# Altium project Output_Protection.PrjPCB
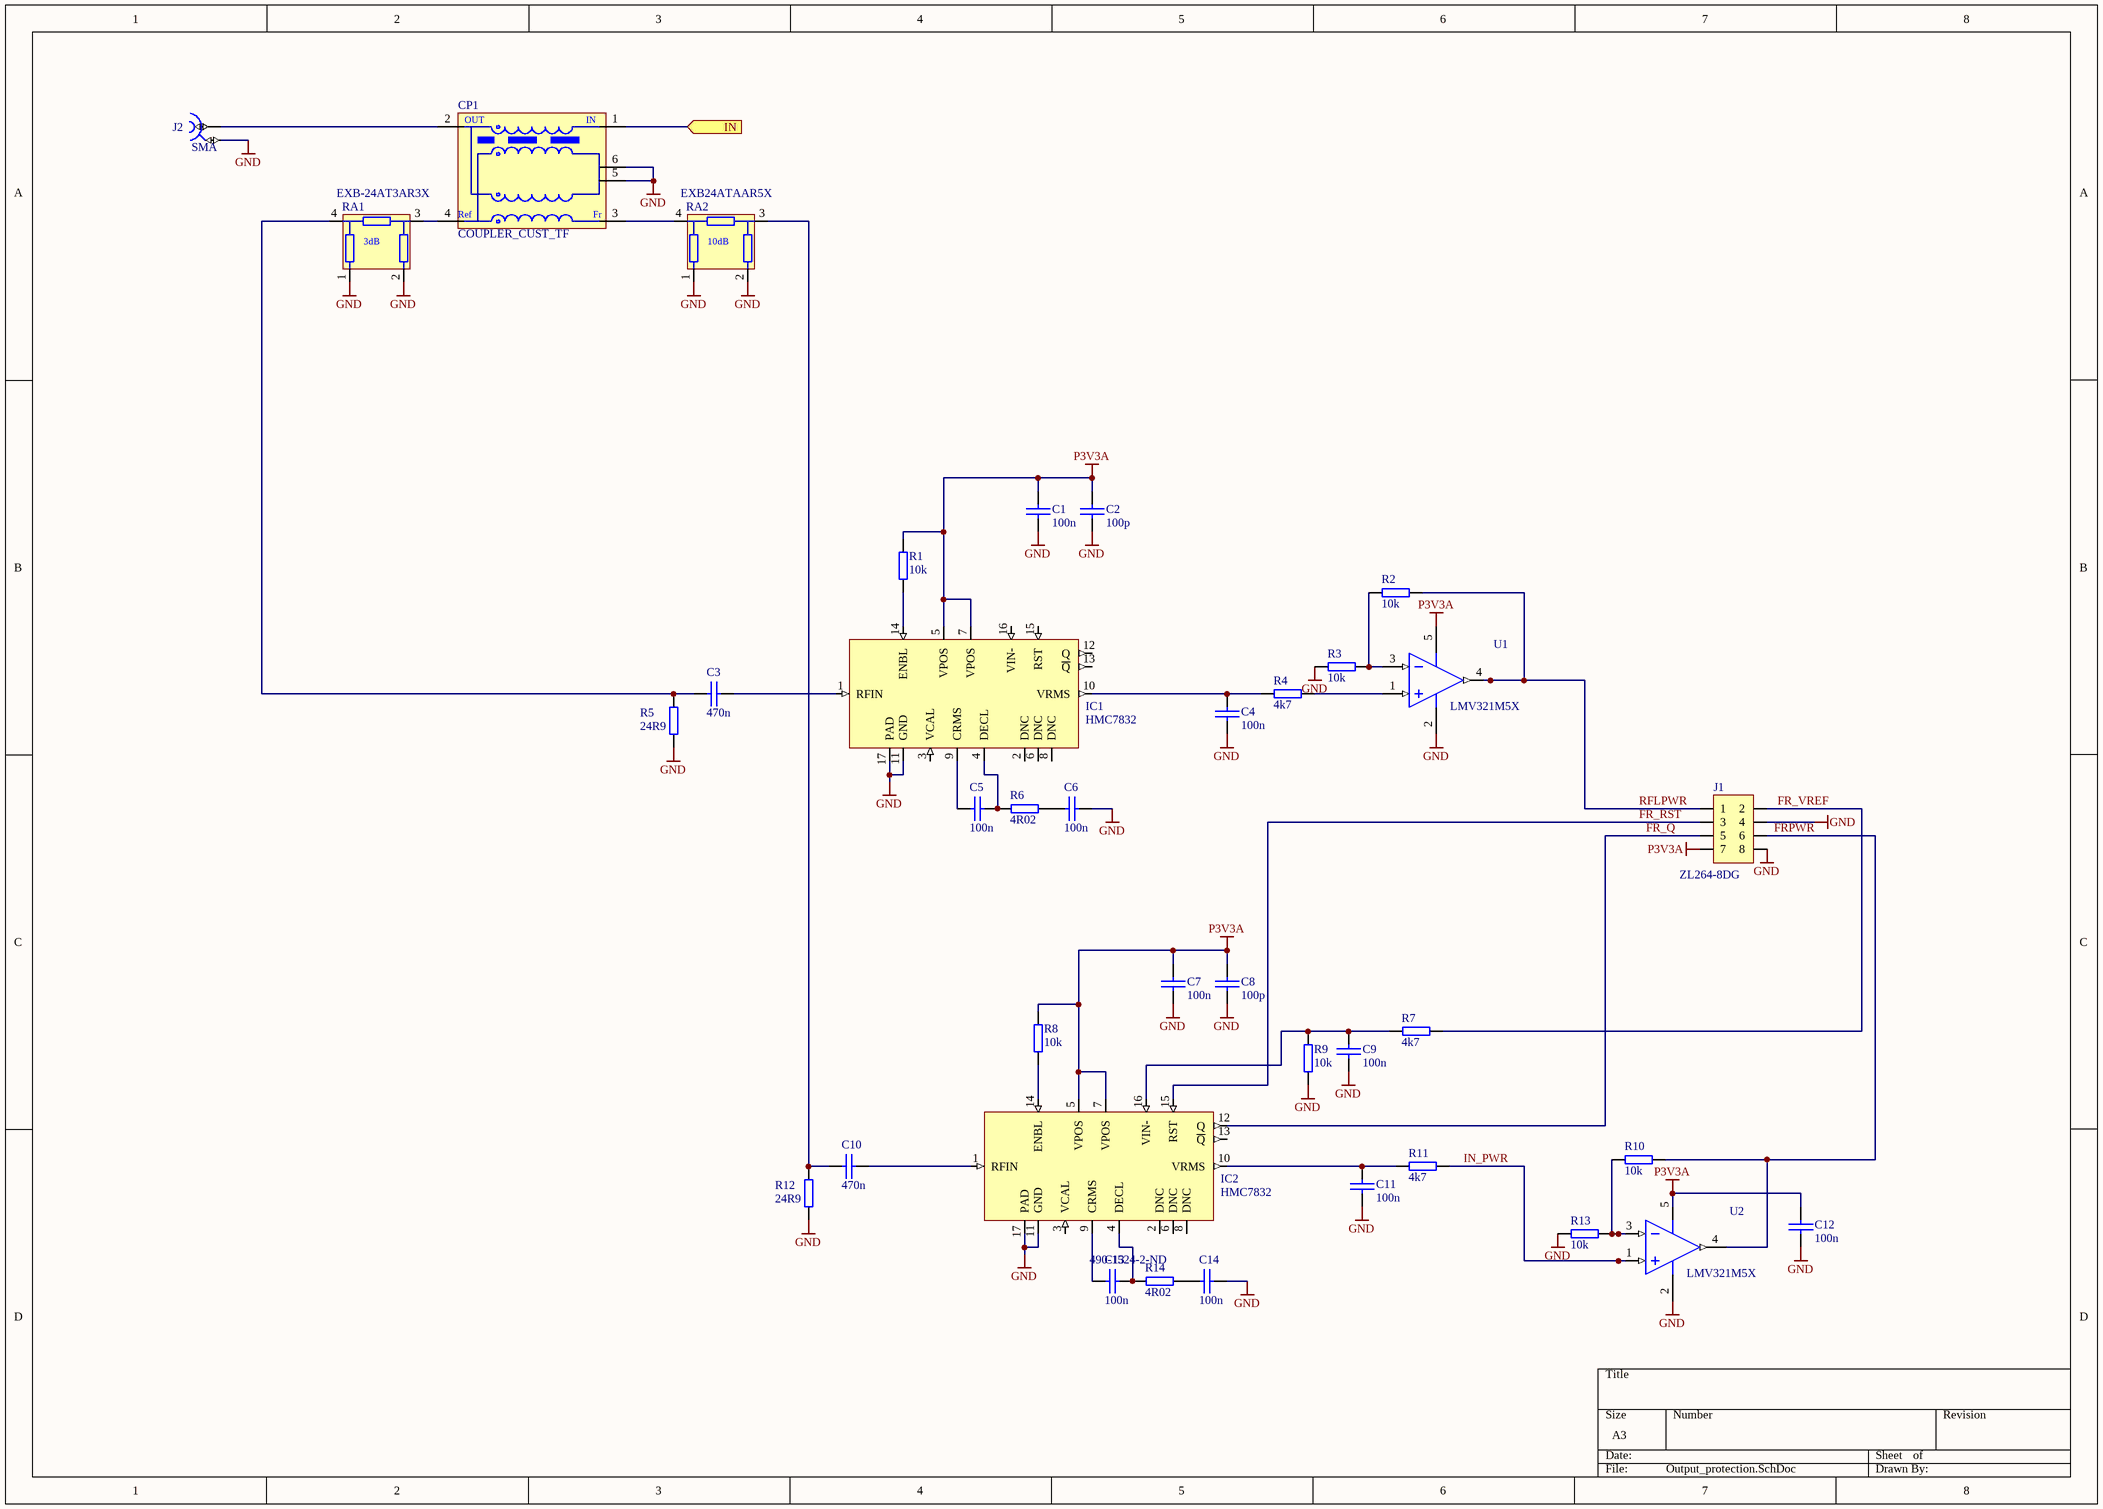
[diagram p0: Output_protection.SchDoc]
1 sheet, 37 parts. Net scope: flat (ports and power ports of the same name join across sheets).
Board file: PA_Channel_RF3.PcbDoc

## Sheet Output_protection.SchDoc
size A3

### Parts
C1  100n  [0603C]
C2  100p  [0603C]
C3  470n  [0603C]
C4  100n  [0603C]
C5  100n  [0603C]
C6  100n  [0603C]
C7  100n  [0603C]
C8  100p  [0603C]
C9  100n  [0603C]
C10  470n  [0603C]
C11  100n  [0603C]
C12  100n  [0603C]
C13  100n  Supplier Part Number 1: 490-1524-2-ND  [0603C]
C14  100n  [0603C]
CP1  COUPLER_CUST_TF  [COUPLER_CUST_TF]
IC1  HMC7832  [QFN50P300X300X80_HS-17N]
IC2  HMC7832  [QFN50P300X300X80_HS-17N]
J1  ZL264-8DG  [ZL264-8DG]
J2  SMA  [MOLEX_73251-2121]
R1  10k  [0603R]
R2  10k  [0603R]
R3  10k  [0603R]
R4  4k7  [0603R]
R5  24R9  [0603R]
R6  4R02  [0603R]
R7  4k7  [0603R]
R8  10k  [0603R]
R9  10k  [0603R]
R10  10k  [0603R]
R11  4k7  [0603R]
R12  24R9  [0603R]
R13  10k  [0603R]
R14  4R02  [0603R]
RA1  EXB-24AT3AR3X  [CAC-65P100X100-4L]
RA2  EXB24ATAAR5X  [CAC-65P100X100-4L]
U1  LMV321M5X  [DBV0005A_N]
U2  LMV321M5X  [DBV0005A_N]

### Ports
IN (in)

### Nets
GND: C1.2 C2.2 C4.1 C6.2 C7.2 C8.2 C9.1 C11.1 C12.1 C14.2 CP1.5 CP1.6 IC1.11(GND) IC1.17(PAD) IC2.11(GND) IC2.17(PAD) J1.4 J1.8 J2.2 R3.2 R5.2 R9.1 R12.2 R13.2 RA1.1 RA1.2 RA2.1 RA2.2 U1.2(V-) U2.2(V-)
P3V3A: C1.1 C2.1 C7.1 C8.1 C12.2 IC1.5(VPOS) IC1.7(VPOS) IC2.5(VPOS) IC2.7(VPOS) J1.7 R1.1 R8.1 U1.5(V+) U2.5(V+)
FR_Q: IC2.12(Q) J1.5
FR_RST: IC2.15(RST) J1.3
FR_VREF: J1.2 R7.1
FRPWR: J1.6 R10.1 U2.4(OUT)
IN_PWR: R11.1 U2.1(IN+)
RFLPWR: J1.1 R2.1 U1.4(OUT)
NetC3_1: C3.1 R5.1 RA1.4
NetC3_2: C3.2 IC1.1(RFIN)
NetC4_2: C4.2 IC1.10(VRMS) R4.2
NetC5_1: C5.1 IC1.9(CRMS)
NetC5_2: C5.2 IC1.4(DECL) R6.1
NetC6_1: C6.1 R6.2
NetC9_2: C9.2 IC2.16(VIN-) R7.2 R9.2
NetC10_1: C10.1 R12.1 RA2.3
NetC10_2: C10.2 IC2.1(RFIN)
NetC11_2: C11.2 IC2.10(VRMS) R11.2
NetC13_1: C13.1 IC2.9(CRMS)
NetC13_2: C13.2 IC2.4(DECL) R14.1
NetC14_1: C14.1 R14.2
NetCP1_1: CP1.1 ; port IN
NetCP1_2: CP1.2 J2.1
NetCP1_3: CP1.3 RA2.4
NetCP1_4: CP1.4 RA1.3
NetIC1_14: IC1.14(ENBL) R1.2
NetIC2_14: IC2.14(ENBL) R8.2
NetR2_2: R2.2 R3.1 U1.3(IN-)
NetR4_1: R4.1 U1.1(IN+)
NetR10_2: R10.2 R13.1 U2.3(IN-)

Not connected (* = marked no-connect by the designer): IC1 2(DNC) 3(VCAL) 6(DNC) 8(DNC) 12(Q) 13(~{Q}) 15(RST) 16(VIN-); IC2 2(DNC) 3(VCAL) 6(DNC) 8(DNC) 13(~{Q})

### Notes on the sheet
- (in symbol IND_COUPLER_TF) OUT; IN; Ref; Fr
- (in symbol RES_ATT_3dB) 3dB
- (in symbol RES_ATT_10dB) 10dB

### Library data of the parts
C1 C4-C7 C9 C11-C14 = CAP_SMD_0603: Capacitor SMD; Part: GRM188L81H104KA93D
  C1 C4-C6 C9 C11 C12 C14: Supplier 1: Digi-Key
C2 C8 = CAP_SMD_0603: Capacitor SMD; Part: C1608NP01H101J080AA; Supplier 1: Digi-Key
C3 C10 = CAP_SMD_0603: Capacitor SMD; Part: GRM188R71A474KA61D; Supplier 1: Digi-Key
CP1 = IND_COUPLER_TF: custom coupler
IC1 IC2 = ADL5904: DC   to 6 GHz  , 45 dB DC  to 6 GHz , 45 dB TruPwr Detector with Envelope Threshold Detection
J1 = CON_2X4 2.54 SMT FEM: 2.54mm pitch connector
J2 = MOLEX_73251-2121: Part Description: 50 Ohm, SMA Edge Mount PCB, With Jam Nut And Lock Washer; Manufacturer: MOLEX; PressFit: No; Part Number: MOLEX_73251-2121; Component Kind: Standard; Component Type: Standard; Pin Count: 5; Family: SMA; Mounted: Yes; Socket: No; SMD: Yes; Sense: No; Status: None; Manufacturer Part Number: 73251-2121; ComponentHeight: 5.75mm; HelpURL: \\cern.ch\dfs\Applications\Altium\Datasheets\MOLEX_73251-2121.pdf; Author: CERN DEM JLC; CreateDate: 26.10.2016; LatestRevisionDate: 26.10.2016
R1-R3 R8-R10 R13 = RES_0603: SMD Resistor; Part: CRCW060310K0FKEA; Supplier 1: Newark
  R2 R3 R8 R10 R13: Supplier Part Number 1: 39K0073
R4 R7 R11 = RES_0603: SMD Resistor; Part: CR0603-FX-4701ELF; Supplier 1: Newark; Supplier Part Number 1: 39K0073
R5 R12 = RES_0603: SMD Resistor; Part: CPF0603F24R9C1; Supplier 1: Newark
R6 = RES_0603: SMD Resistor; Part: CRCW06034R02FKEA; Supplier 1: Newark
R14 = RES_0603: SMD Resistor; Supplier 1: Newark; Supplier Part Number 1: 39K0073
RA1 = RES_ATT_3dB: 3dB Chip Attenuator
RA2 = RES_ATT_10dB: 10dB Chip Attenuator
U1 U2 = CMP-0055-01048-3: General Purpose, Low Voltage, Rail-to-Rail Output Operational Amplifiers, 5-pin SOT-23; Manufacturer: Texas Instruments; PackageTopMarking: A13*XTT; PowerWise: N; Package Reference: DBV0005A; PackageDescription: Molded SOT-23, .115 x .063 x .040 in Body, 5 Lead, .0375 in Pitch; CompType: Amplifiers; RoHS: N; ComponentLink1URL: http://www.ti.com/general/docs/lit/getliterature.tsp?genericPartNumber=LMV321-N&fileType=pdf; PinCount: 5; ComponentLink1Description: Datasheet URL